# EAGLE design ESP32UsbHost (EAGLE 8.7.0)
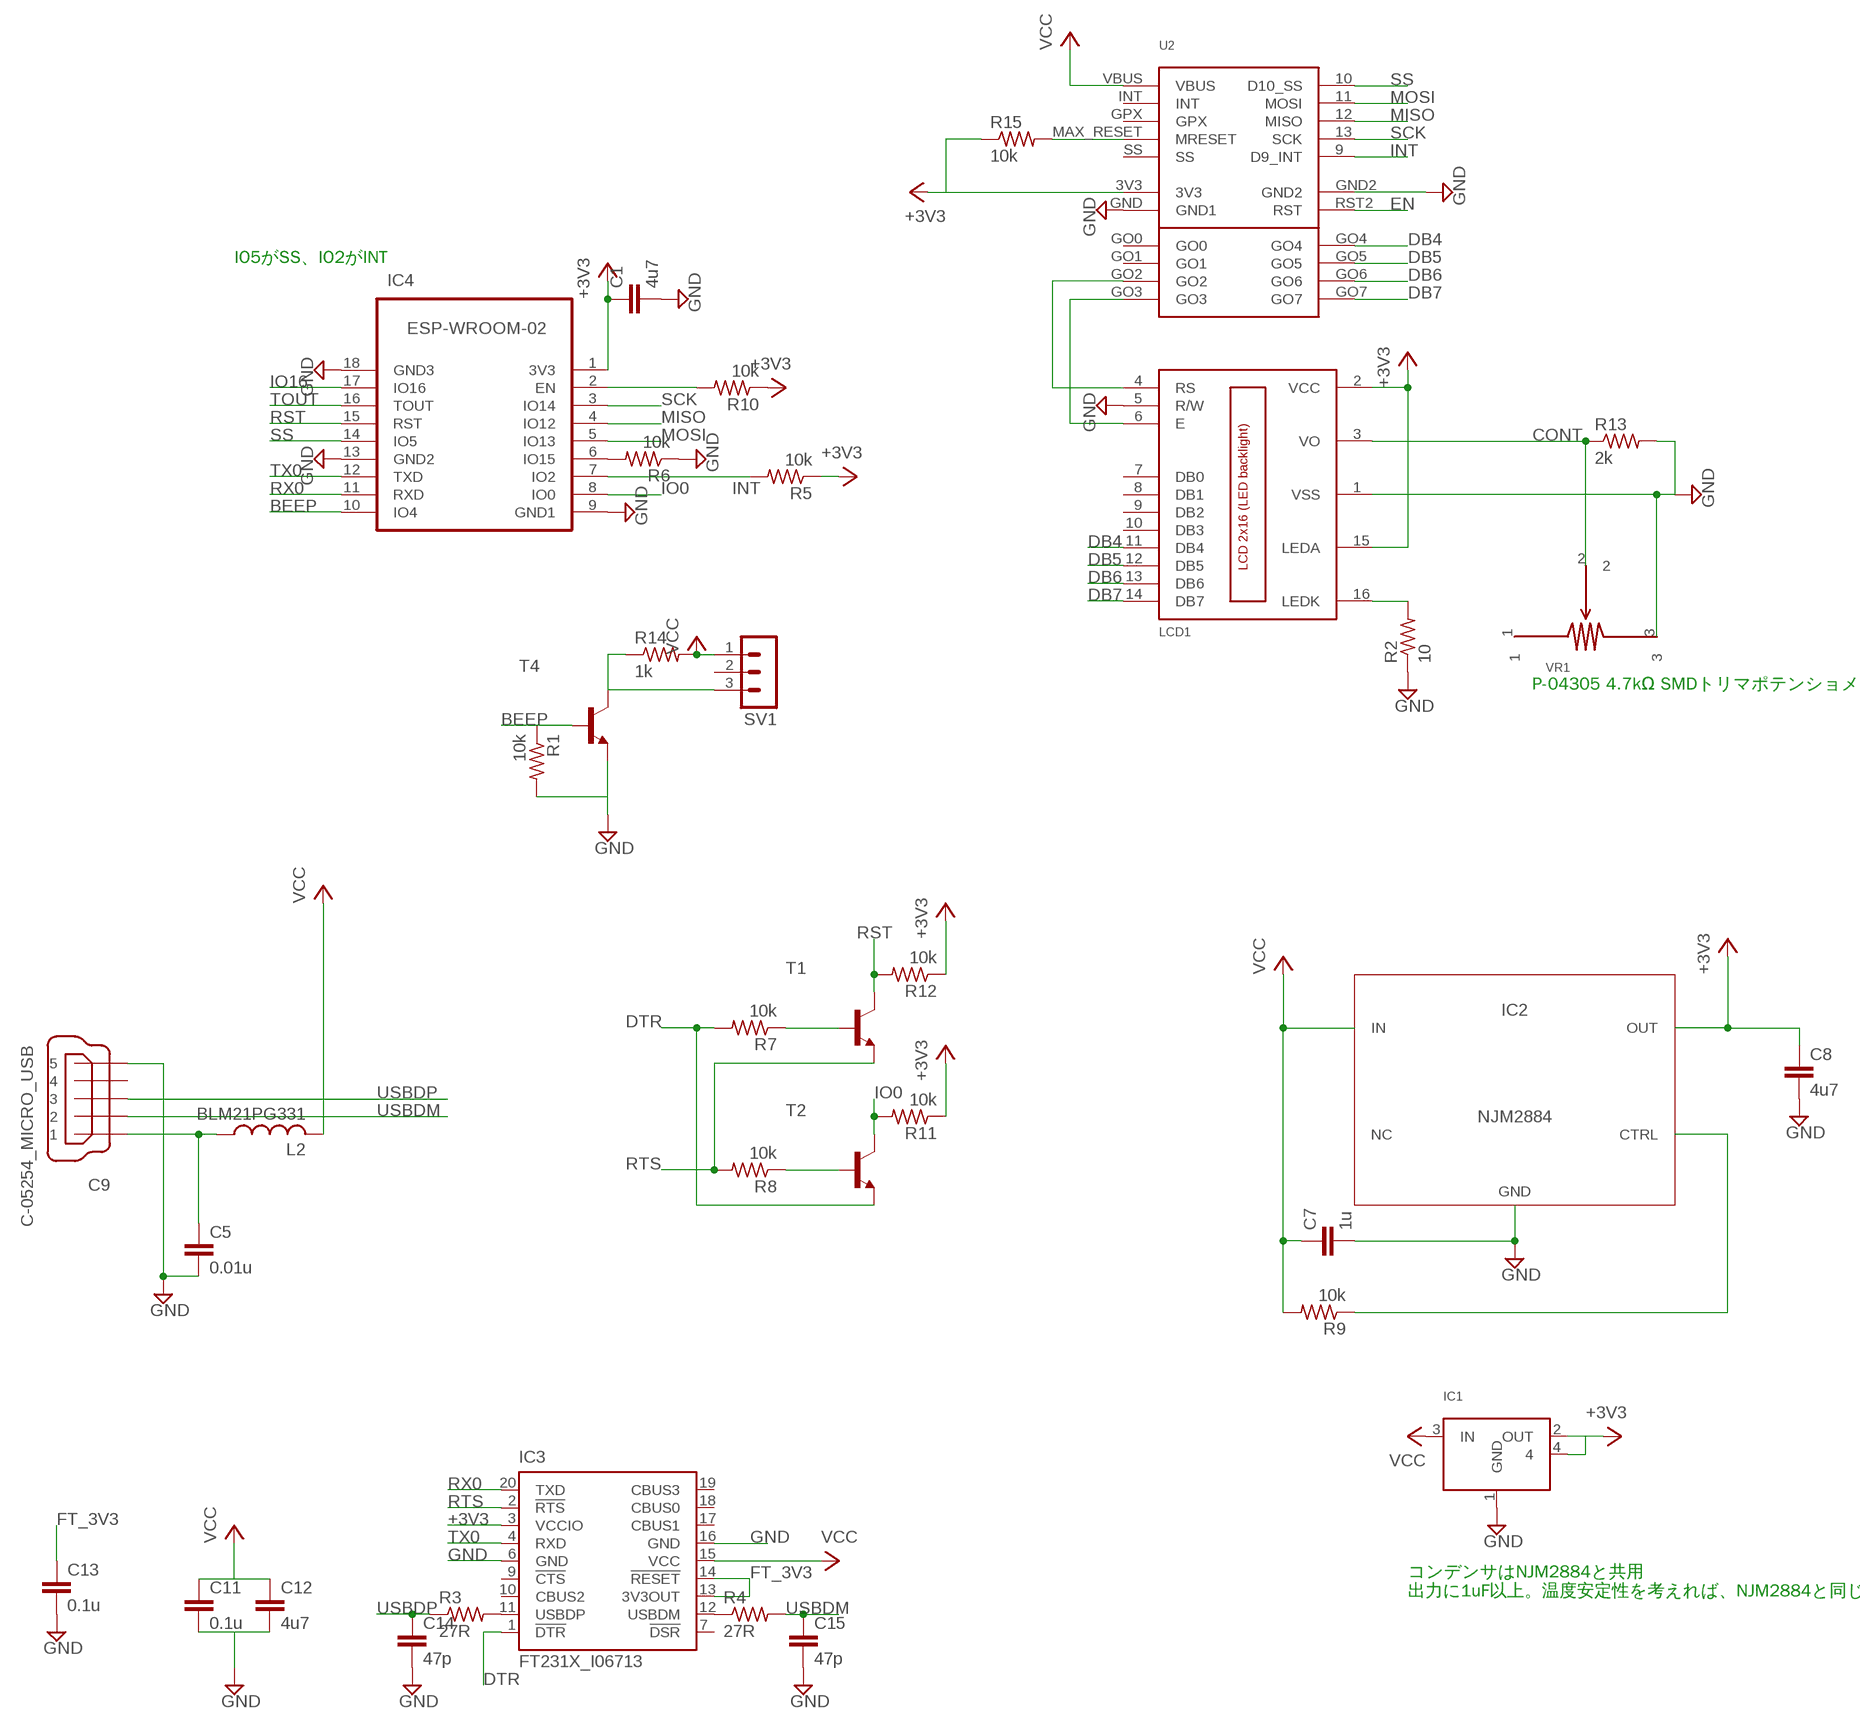
[diagram p0: schematic, sheet 1]

## Parts
C1  4u7  C-EUC0603  [C0603]
C5  0.01u  C-EUC0603  [C0603]
C7  1u  C-EUC0603  [C0603]
C8  4u7  C-EUC0603  [C0603]
C9  C-05254_MICRO_USB  [C-05254_MICRO_USB]
C11  0.1u  C-EUC0603  [C0603]
C12  4u7  C-EUC0603  [C0603]
C13  0.1u  C-EUC0603  [C0603]
C14  47p  C-EUC0603  [C0603]
C15  47p  C-EUC0603  [C0603]
IC1  I-12635_ADP3338AKCZ  [SOT223]
IC2  NJM2884  [SOT89-5]
IC3  FT231X_I06713  [SSOP20(2)]
IC4  ESP-WROOM-02  [FRONT-FACE_HANDSOLDER]
L2  BLM21PG331  L-USL2012C  [L2012C]
LCD1  LCD_2X16CONN_ONLY  [HY-1602F_2]
R1  10k  R-US_R0603  [R0603]
R2  10  R-US_R0603  [R0603]
R3  27R  R-US_R0603  [R0603]
R4  27R  R-US_R0603  [R0603]
R5  10k  R-US_R0603  [R0603]
R6  10k  R-US_R0603  [R0603]
R7  10k  R-US_R0603  [R0603]
R8  10k  R-US_R0603  [R0603]
R9  10k  R-US_R0603  [R0603]
R10  10k  R-US_R0603  [R0603]
R11  10k  R-US_R0603  [R0603]
R12  10k  R-US_R0603  [R0603]
R13  2k  R-US_R0603  [R0603]
R14  1k  R-US_R0603  [R0603]
R15  10k  R-US_R0603  [R0603]
SV1  MA03-1  [MA03-1]
T1  BC808-NPN-SOT23-BEC  [SOT23-BEC]
T2  BC808-NPN-SOT23-BEC  [SOT23-BEC]
T4  BC808-NPN-SOT23-BEC  [SOT23-BEC]
U2  USB_HOST_MINI  [USB_HOST_MINI]
VR1  P-04305_PVZ3_VR_POTENTION_METER  [VR_POTENTION_METER]

## Nets
+3V3 [pow]: C1.1 C8.1 IC1.2(OUT) IC1.4 IC2.4(OUT) IC3.3(VCCIO) IC4.1(3V3) LCD1.2(VCC) LCD1.15(LEDA) R5.1 R10.1 R11.1 R12.1 R15.1 U2.3V3
BEEP: IC4.10(IO4) R1.1 T4.B
CONT: LCD1.3(VO) R13.1 VR1.2
DB4: LCD1.11(DB4) U2.GO4
DB5: LCD1.12(DB5) U2.GO5
DB6: LCD1.13(DB6) U2.GO6
DB7: LCD1.14(DB7) U2.GO7
DTR: IC3.1(!DTR) R7.2 T2.E
EN: U2.RST2(RST)
FT_3V3: C13.1 IC3.13(3V3OUT) IC3.14(!RESET)
GND [pow]: C1.2 C5.2 C7.2 C8.2 C9.5 C11.2 C12.2 C13.2 C14.2 C15.2 IC1.1(GND) IC2.2(GND) IC3.6(GND) IC3.16(GND) IC4.9(GND1) IC4.13(GND2) IC4.18(GND3) LCD1.1(VSS) LCD1.5(R/W) R1.2 R2.1 R6.1 R13.2 T4.E U2.GND2 U2.GND(GND1) VR1.3
INT: IC4.7(IO2) R5.2 U2.9(D9_INT)
IO0: IC4.8(IO0) R11.2 T2.C
IO16: IC4.17(IO16)
MISO: IC4.4(IO12) U2.12(MISO)
MOSI: IC4.5(IO13) U2.11(MOSI)
N$1: IC4.6(IO15) R6.2
N$2: LCD1.6(E) U2.GO3
N$3: LCD1.4(RS) U2.GO2
N$4 [pow]: LCD1.16(LEDK) R2.2
N$5: IC3.12(USBDM) R4.1
N$6: IC3.11(USBDP) R3.2
N$7: IC4.2(EN) R10.2
N$8: R14.1 SV1.3 T4.C
N$9: R15.2 U2.MAX_RESET(MRESET)
N$10: R7.1 T1.B
N$11 [pow]: C5.1 C9.1 L2.1
N$14: R8.1 T2.B
N$17: IC2.1(CTRL) R9.1
RST: IC4.15(RST) R12.2 T1.C
RTS: IC3.2(!RTS) R8.2 T1.E
RX0: IC3.20(TXD) IC4.11(RXD)
SCK: IC4.3(IO14) U2.13(SCK)
SS: IC4.14(IO5) U2.10(D10_SS)
TOUT: IC4.16(TOUT)
TX0: IC3.4(RXD) IC4.12(TXD)
USBDM: C9.2 C15.1 R4.2
USBDP: C9.3 C14.1 R3.1
VCC [pow]: C7.1 C11.1 C12.1 IC1.3(IN) IC2.5(IN) IC3.15(VCC) L2.2 R9.2 R14.2 SV1.1 U2.VBUS
Unconnected: C9.4 IC2.3(NC) IC3.7(!DSR) IC3.9(!CTS) IC3.10(CBUS2) IC3.17(CBUS1) IC3.18(CBUS0) IC3.19(CBUS3) LCD1.7(DB0) LCD1.8(DB1) LCD1.9(DB2) LCD1.10(DB3) SV1.2 U2.GO0 U2.GO1 U2.GPX U2.INT U2.SS VR1.1

## Notes on the sheet
- IO5がSS、IO2がINT
- P-04305 4.7kΩ SMDトリマポテンショメータ
- コンデンサはNJM2884と共用
  出力に1uF以上。温度安定性を考えれば、NJM2884と同じく4u7。

## Library data of the parts
C1 C5 C7 C8 C11-C15 = rcl:C-EU: CAPACITOR, European symbol; SPICEPREFIX: C
C9 = Akizuki:C-05254_MICRO_USB
IC1 = Akizuki:I-12635_ADP3338AKCZ
IC2 = nrj-semiconductor:NJM2884
IC3 = Akizuki:FT231X_I06713
IC4 = esp-wroom-02:ESP-WROOM-02: WiFi module - ESP-WROOM-02
L2 = rcl:L-US: INDUCTOR, American symbol; SPICEPREFIX: L
LCD1 = lcd_2x16_led_backlight:LCD_2X16
R1-R15 = rcl:R-US_: RESISTOR, American symbol; SPICEPREFIX: R
SV1 = con-lstb:MA03-1: PIN HEADER; OC_FARNELL: unknown; OC_NEWARK: unknown
T1 T2 T4 = transistor-neu-to92:*-NPN-: NPN Transistror
U2 = Amazon:USB_HOST_MINI
VR1 = Akizuki:P-04305_PVZ3_VR_POTENTION_METER

## Board
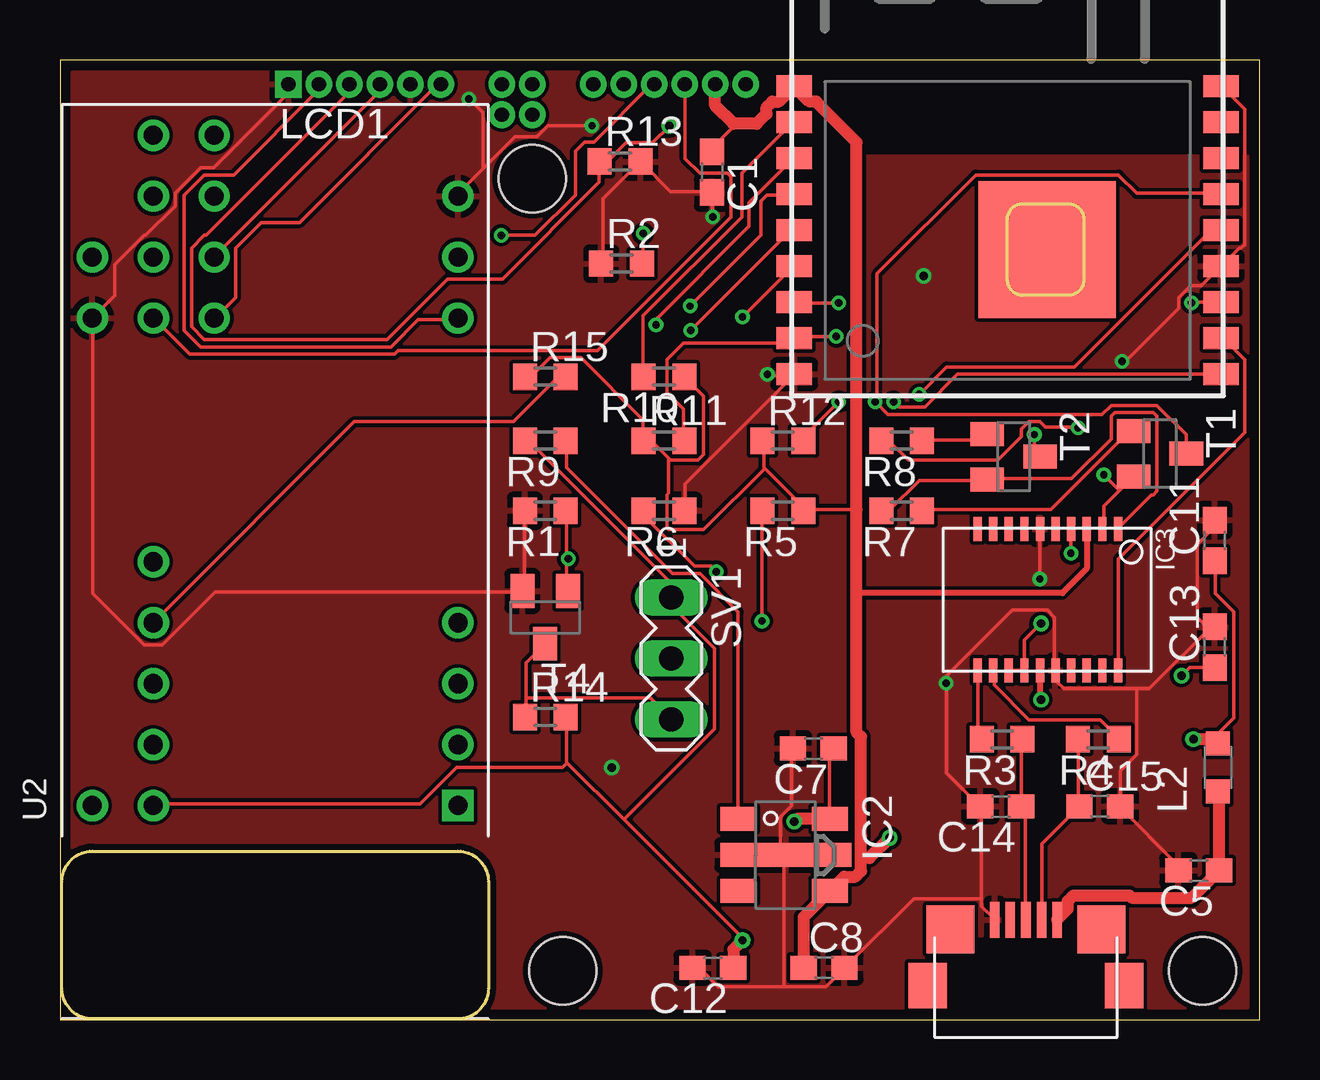
[diagram p1: board, top side]
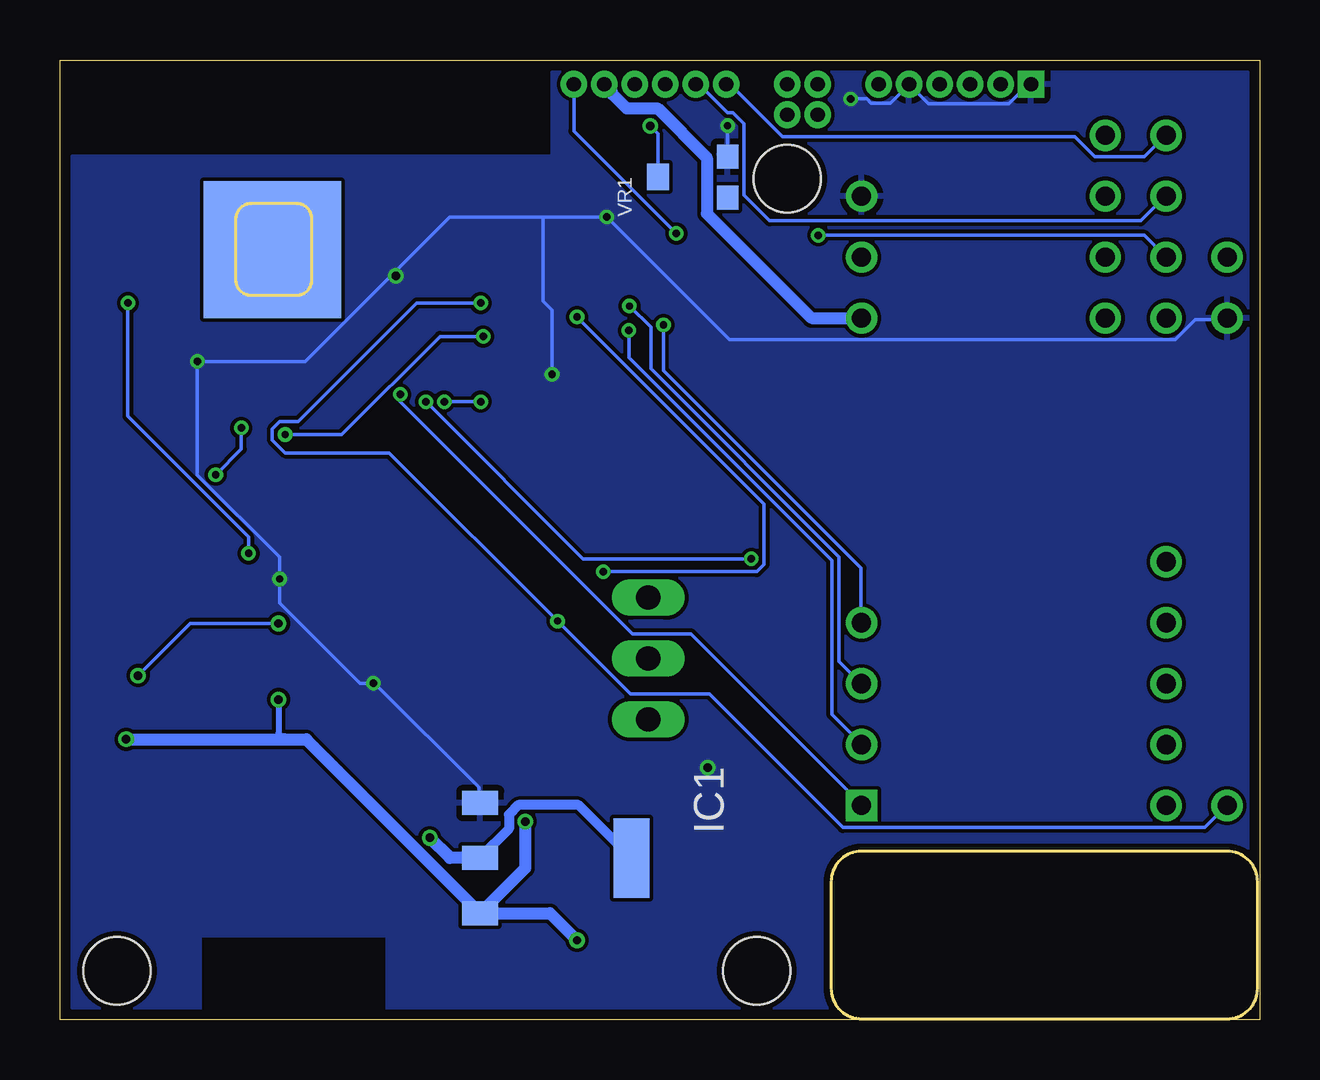
[diagram p2: board, bottom side, seen from below]

Size 50 x 40 mm. Coordinates in mm from the lower left corner, seen from the top.
Outline: 0,0 50,0 50,40 0,40 0,0
Copper layers (1*16): Top 0.035mm / dielectric 1.5mm / Bottom 0.035mm
Design rules "SeeedStudio_2layer_DRU_no_angle_20140221": minimum track width 6mil, minimum drill 12mil, track to track 6mil, track to pad 6mil, pad to pad 6mil, via to via 6mil, smd to smd 0mil, copper to edge 10mil, drill to drill 10mil, minimum pad ring 10mil, minimum via ring 6mil, stop-mask expansion 2mil, vias tented up to drill 100mil, thermal gap 10mil
Holes 2.8 mm at 19.68,35.05 47.62,2.03 20.95,2.03
vRestrict: area 36.8,7.6 to 45.7,12.7; area 18,19.6 to 36.8,25.4; area 17.8,25.1 to 27.1,27.9; area 36.7,22 to 39.1,23.4

### Footprints (pad centres in the part's own frame; a part is rotated, then mirrored left to right if it is on the bottom)
C0603 = smd 1.1 x 1: 1 -0.85,0; 2 0.85,0
C-05254_MICRO_USB = smd 0.4 x 1.5: 1 1.3,0.75; 2 0.65,0.75; 3 0,0.75; 4 -0.65,0.75; 5 -1.3,0.75 | smd 2 x 2: NC1 3.15,0.35; NC2 -3.15,0.35 | smd 1.6 x 1.9: P$6 -4.1,-2; P$7 4.1,-2
SOT223 = smd 1 x 1.5: 1 -2.3,0; 2 0,0; 3 2.3,0 | smd 3.3 x 1.5: 4 0,6.3
SOT89-5 = smd 1 x 1.5: 1 -1.499,-1.981; 3 1.499,-1.981; 4 1.499,1.829; 5 -1.499,1.829 | smd 1 x 5.454: 2 0,0
SSOP20(2) = smd 0.35 x 1: 1 -2.95,-2.95; 2 -2.3,-2.95; 3 -1.65,-2.95; 4 -1,-2.95; 5 -0.35,-2.95; 6 0.3,-2.95; 7 0.95,-2.95; 8 1.6,-2.95; 9 2.25,-2.95; 10 2.9,-2.95; 11 2.9,2.95; 12 2.25,2.95; 13 1.6,2.95; 14 0.95,2.95; 15 0.3,2.95; 16 -0.35,2.95; 17 -1,2.95; 18 -1.65,2.95; 19 -2.3,2.95; 20 -2.95,2.95
FRONT-FACE_HANDSOLDER = smd 1.485 x 0.9: 1 -8.893,4.9; 2 -8.893,3.4; 3 -8.893,1.9; 4 -8.893,0.4; 5 -8.893,-1.1; 6 -8.893,-2.6; 7 -8.893,-4.1; 8 -8.893,-5.6; 9 -8.893,-7.1; 10 8.893,-7.1; 11 8.893,-5.6; 12 8.893,-4.1; 13 8.893,-2.6; 14 8.893,-1.1; 15 8.893,0.4; 16 8.893,1.9; 17 8.893,3.4; 18 8.893,4.9 | smd 5.715 x 5.715: P$1 1.651,-1.905 | smd 5.715 x 5.715 bottom: P$2 1.651,-1.905
L2012C = smd 1 x 1: 1 -1,0; 2 1,0
HY-1602F_2 = drill 0.6 square: 1 0,0 | drill 0.6: 2 1.27,0; 3 2.54,0; 4 3.81,0; 5 5.08,0; 6 6.35,0; 7 8.89,0; 8 10.16,0; 9 8.89,-1.27; 10 10.16,-1.27; 11 12.7,0; 12 13.97,0; 13 15.24,0; 14 16.51,0; 15 17.78,0; 16 19.05,0
R0603 = smd 1 x 1.1: 1 -0.85,0; 2 0.85,0
MA03-1 = drill 1.016 long: 1 -2.54,0; 2 0,0; 3 2.54,0
SOT23-BEC = smd 1 x 1.4: B -0.95,-1.1; C 0,1.1; E 0.95,-1.1
USB_HOST_MINI = drill 0.8: 3V3 21.59,1.27; 9 1.27,16.51; 11 3.81,1.27; 12 6.35,1.27; 13 8.89,1.27; GND 26.67,1.27; GND2 21.59,16.51; GO0 29.21,11.43; GO1 26.67,11.43; GO2 24.13,11.43; GO3 21.59,11.43; GO4 29.21,13.97; GO5 26.67,13.97; GO6 24.13,13.97; GO7 21.59,13.97; GPX 6.35,13.97; INT 3.81,13.97; MAX_RESET 8.89,13.97; NC 24.13,1.27; RST2 24.13,16.51; SS 11.43,13.97; VBUS 1.27,13.97 | drill 0.8 square: 10 1.27,1.27
VR_POTENTION_METER = smd 1 x 0.9: 1 -0.85,-1.45; 3 0.85,-1.45 | smd 1.1 x 0.9: 2 0,1.45

### Placement (x,y rotation side)
C1  27.18,35.32 270 top
C5  47.47,6.22 180 top
C7  31.4,11.3 180 top
C8  31.85,2.16 0 top
C9  40.26,3.41 0 top
C11  48.13,19.97 90 top
C12  27.21,2.16 180 top
C13  48.13,15.53 90 top
C14  39.21,8.89 180 top
C15  43.34,8.89 0 top
IC1  32.48,6.73 270 bottom
IC2  30.26,6.86 270 top
IC3  41.15,17.5 180 top
IC4  39.5,34.01 0 top
L2  48.26,10.51 90 top
LCD1  9.53,38.99 0 top
R1  20.23,21.21 180 top
R2  23.41,31.51 0 top
R3  39.27,11.68 180 top
R4  43.28,11.68 180 top
R5  30.13,21.21 180 top
R6  25.18,21.21 180 top
R7  35.08,21.21 180 top
R8  35.08,24.13 180 top
R9  20.23,24.13 180 top
R10  25.18,26.8 180 top
R11  25.18,24.13 0 top
R12  30.13,24.13 0 top
R13  23.34,35.77 0 top
R14  20.23,12.61 0 top
R15  20.23,26.8 0 top
SV1  25.48,15.05 270 top
T1  45.85,23.59 270 top
T2  39.75,23.46 270 top
T4  20.23,16.76 180 top
U2  17.86,7.65 90 top
VR1  23.62,35.12 90 bottom

### Tracks (layer width: path | path; a pad name or v marks a point on that pad's centre or on a via)
+3V3  (via drill 0.35)
  Top 0.152: 25.41,23.36 25.45,23.32 26.59,23.32 26.82,23.55 26.82,25.98 26.06,26.75 R10.1 | 25.41,23.36 24.69,24.08 24.38,24.08 R11.1 24.31,24.16 24.31,24.99 21.72,27.58 20.42,27.58 19.66,26.82 19.43,26.82 R15.1 | 33.21,21.26 31.01,21.26 R5.1 31.01,21.34 29.38,22.97 | 29.38,22.97 29.34,23.01 29.34,24.08 R12.1 | C1.1 27.2,36.2 27.2,36.35 27.96,37.11 28.07,37.34 | LCD1.2 10.74,38.94 10.74,38.71 7.24,35.2 6.02,35.2 5.18,34.37 5.18,28.73 5.87,28.04 13.79,28.04 14.94,29.18 16.54,29.18 U2.3V3 | 29.38,22.97 26.82,20.42 25.38,20.42 25.3,20.5 25.3,21.87 25.38,21.95 25.38,23.32 25.41,23.36 | 33.3,7.7 33.39,7.7
  Top 0.254: IC3.3 42.8,18.8 41.78,17.78 33.21,17.78
  Top 0.508: LCD1.15 27.3,38.1 28.07,37.34 29.04,37.34 29.46,37.76 29.46,38.02 29.69,38.26 29.96,38.26 IC4.1 31.25,38.26 31.52,38.26 33.21,36.57 33.21,21.26 33.21,17.78 33.21,11.97 33.39,11.79 33.39,7.7 33.39,6.73 | 33.39,6.73 33.39,6.19 33.15,5.95 32.68,5.95 IC2.4 31,4.27 C8.1 | v34.59,7.58 33.74,6.73 33.39,6.73
  Bottom 0.152: 32.46,6.78 IC1.2
  Bottom 0.406: 32.46,6.78 31.29,7.95 31.29,8.54 30.89,8.94 28.39,8.94 IC1.4
  Bottom 0.508: U2.3V3 18.67,29.24 23.03,33.6 23.03,35.92 25.1,37.98 26.38,37.98 27,38.59 27,38.68 LCD1.15 | IC1.2 33.74,6.73 v34.59,7.58
BEEP  (via drill 0.3)
  Top 0.152: 21.11,19.2 21.11,17.91 T4.B | 21.11,19.2 21.11,21.18 R1.1 | v34.75,25.76 34.98,25.53 36.04,25.53 37.41,26.9 IC4.10 | 21.11,19.2 v21.18,19.2
  Bottom 0.152: v34.75,25.76 28.19,19.2 v21.18,19.2
CONT  (via drill 0.35)
  Top 0.152: LCD1.3 12.04,38.94 12.04,38.63 6.1,32.69 6.02,32.69 5.49,32.16 5.49,28.88 6.02,28.35 13.64,28.35 16.15,30.86 18.44,30.86 22.48,34.9 22.48,35.74 R13.1 22.82,35.77 23.59,36.55 24.7,36.55 v25.4,37.25
  Bottom 0.152: VR1.2 25.07,36.92 v25.4,37.25
DB4
  Bottom 0.152: LCD1.11 22.17,38.94 22.02,38.94 19.89,36.8 7.7,36.8 6.86,35.97 4.8,35.97 3.96,36.8 U2.GO4
DB5
  Bottom 0.152: LCD1.12 23.47,38.94 23.32,38.94 22.17,37.8 21.95,37.8 21.49,37.34 21.49,34.37 20.42,33.3 4.95,33.3 3.96,34.29 U2.GO5
DB6  (via drill 0.3)
  Top 0.152: v18.39,32.69 19.81,32.69 21.49,34.37 21.49,36.2 21.87,36.58 22.25,36.58 24.61,38.94 24.77,38.94 LCD1.13
  Bottom 0.152: v18.39,32.69 4.8,32.69 3.96,31.85 U2.GO6
DB7
  Top 0.152: LCD1.14 26.06,38.94 26.06,35.89 26.67,35.28 27.81,35.28 27.96,35.13 27.96,33.45 22.4,27.89 14.1,27.89 13.95,27.74 5.41,27.74 3.96,29.18 U2.GO7
DTR
  Top 0.152: IC3.1 44.12,20.5 45.49,21.87 45.57,21.87 45.72,22.02 45.72,25.15 45.57,25.3 43.97,25.3 43.81,25.15 43.81,24.2 42.16,22.55 38.71,22.55 T2.E 38.63,22.48 35.81,22.48 34.59,21.26 34.29,21.26 R7.2
FT_3V3  (via drill 0.35)
  Top 0.152: 40.08,14.55 40.16,14.55 IC3.14 | 40.08,14.55 39.62,14.55 IC3.13 | 40.08,14.55 IC3.14 | IC3.14 40.2,15.81 v40.89,16.51 | v46.75,14.34 47.08,14.68 C13.1
  Bottom 0.152: v40.89,16.51 44.58,16.51 v46.75,14.34
GND  (via drill 0.3, 0.35)
  Top 0.152: v22.17,37.26 20.34,37.26 19.89,36.8 18.97,36.8 17.63,35.46 | 17.63,35.46 16.54,34.37 U2.GND | R1.2 19.36,21.18 19.36,17.98 19.28,17.91 T4.E 19.2,17.83 6.48,17.83 4.27,15.62 3.5,15.62 1.37,17.75 1.37,29.18 U2.GND2 1.37,29.26 2.29,30.18 2.29,31.47 3.5,32.69 3.58,32.69 4.8,33.91 4.8,34.44 5.87,35.51 6.4,35.51 9.53,38.63 LCD1.1 | C5.2 46.56,6.25 46.56,6.48 44.2,8.84 C15.2 44.2,8.91 44.2,10.36 44.88,11.05 44.88,13.79 | 44.88,13.79 45.41,13.79 47.93,16.31 48.08,16.31 C13.2 47.85,16.31 47.4,16.76 47.4,19.81 48.08,20.5 48.08,20.8 C11.2 | 44.88,13.79 41.83,13.79 41.53,14.1 41.53,14.48 IC3.16 | C7.2 30.48,11.28 30.48,8.91 30.02,8.46 30.02,7.09 IC2.2 30.18,6.86 30.18,1.37 | 38.41,5.03 38.41,4.72 38.94,4.19 C9.5 | 38.41,5.03 38.41,8.84 C14.2 38.33,8.91 36.96,10.29 36.96,14.02 | 30.18,1.37 31.93,1.37 32.69,2.13 C8.2 32.77,2.21 35.59,5.03 38.41,5.03 | 30.18,1.37 27.43,1.37 26.67,2.13 26.36,2.13 C12.2 | 41.45,15.01 41.45,14.55 | 41.45,14.55 IC3.16 | R6.1 26.06,21.26 26.06,22.33 30.63,26.9 IC4.9 30.4,26.75 v29.49,26.9 | R2.1 22.63,31.55 22.63,34.21 24.16,35.74 R13.2 24.23,35.74 25.45,34.52 27.13,34.52 C1.2 27.2,34.44 v27.2,33.45 | IC4.13 48.46,31.47 49.15,32.16 49.23,32.16 49.38,32.31 49.38,37.95 48.46,38.86 IC4.18 | v40.84,18.36 40.84,20.42 IC3.6 | 48.23,31.39 48.39,31.39 IC4.13 | v44.27,27.43 44.42,27.43 46.63,29.65 46.63,30.09 47.13,30.58 47.57,30.58 IC4.13 | 41.45,14.56 41.45,14.55 | v17.04,38.38 17.63,37.8 17.63,35.46 | 36.96,14.02 36.96,14.33 39.7,17.07 41.15,17.07 41.45,16.76 41.45,15.01 | 36.96,14.02 v36.93,14.02 | 41.45,15.01 IC3.16
  Bottom 0.152: v22.17,37.26 22.17,36.04 VR1.3 | LCD1.5 13.79,38.18 10.44,38.18 9.68,38.94 9.53,38.94 LCD1.1 | 14.48,38.79 LCD1.5 | 32.54,9.07 IC1.1 32.54,9.14 32.54,9.68 36.88,14.02 v36.93,14.02 37.49,14.02 40.84,17.37 v40.84,18.36 40.84,19.28 44.27,22.71 v44.27,27.43 39.78,27.43 33.76,33.45 29.87,33.45 | 29.87,33.45 v27.2,33.45 22.1,28.35 3.5,28.35 2.67,29.18 1.37,29.18 U2.GND2 | v29.49,26.9 29.49,29.57 29.87,29.95 29.87,33.45 | v17.04,38.38 16.37,38.38 16.2,38.21 15.39,38.21 LCD1.5
  other vias: 23,10.5 36,31
  pour Bottom: 0.5,39.5 29.5,39.5 29.5,36 49.5,36 49.5,0.5 0.5,0.5
  pour Top: 0.5,39.5 29.5,39.5 29.5,36 49.5,36 49.5,0.5 0.5,0.5
INT  (via drill 0.3)
  Top 0.152: v29.26,16.61 29.26,21.18 R5.2 | v32.46,29.87 30.63,29.87 IC4.7
  Bottom 0.152: U2.9 1.37,8.91 2.29,8 17.37,8 22.94,13.56 26.21,13.56 v29.26,16.61 36.27,23.62 40.61,23.62 41.15,24.16 41.15,24.61 40.84,24.92 40.08,24.92 35.13,29.87 v32.46,29.87
IO0  (via drill 0.3)
  Top 0.152: R11.2 25.98,24.16 25.98,25.45 25.3,26.14 25.3,27.51 25.98,28.19 30.4,28.19 30.56,28.35 IC4.8 30.63,28.42 30.68,28.47 v32.36,28.47 | T2.C 40.62,23.7 v40.62,24.38
  Bottom 0.152: v32.36,28.47 34.16,28.47 38.25,24.38 v40.62,24.38
MISO  (via drill 0.3)
  Top 0.152: IC4.4 30.56,34.37 29.46,34.37 29.21,34.11 29.21,32.69 v26.26,29.74
  Bottom 0.152: U2.12 16.61,14.02 17.53,14.94 17.53,19.28 25.38,27.13 25.38,28.85 v26.26,29.74
MOSI  (via drill 0.3)
  Top 0.152: v26.29,28.73 30.4,32.84 30.56,32.84 IC4.5
  Bottom 0.152: v26.29,28.73 26.29,27.58 17.83,19.13 17.83,12.72 16.61,11.51 U2.11
N$1  (via drill 0.3)
  Top 0.152: v27.36,18.67 27.13,18.9 26.44,18.9 24.38,20.95 24.38,21.18 R6.2 | v28.45,29.29 30.56,31.39 IC4.6
  Bottom 0.152: v27.36,18.67 20.95,18.67 20.65,18.97 20.65,21.49 v28.45,29.29
N$2
  Top 0.152: LCD1.6 15.85,38.94 15.7,38.94 9.98,33.22 8.38,33.22 7.32,32.16 7.32,30.1 6.48,29.26 U2.GO3
N$3
  Top 0.152: LCD1.4 13.34,38.71 6.48,31.85 U2.GO2
N$4  (via drill 0.3)
  Top 0.152: v24.31,32.77 24.31,31.55 R2.2
  Bottom 0.152: v24.31,32.77 28.57,37.03 LCD1.16
N$5
  Top 0.152: IC3.12 38.94,14.48 38.94,13.95 40.39,12.5 43.36,12.5 44.12,11.73 R4.1
N$6
  Top 0.152: IC3.11 38.25,14.48 38.25,11.89 38.41,11.73 R3.2
N$7
  Top 0.152: R10.2 24.31,26.82 24.31,29.34 28.42,33.45 28.42,35.28 30.56,37.41 IC4.2
N$8
  Top 0.152: 19.43,13.41 19.43,14.86 20.19,15.62 T4.C | 19.43,13.41 19.43,12.65 R14.1 | 19.43,13.41 24.61,13.41 25.45,12.57 SV1.3
N$9
  Top 0.152: R15.2 21.03,26.75 20.73,26.75 18.9,24.92 12.27,24.92 3.96,16.61 U2.MAX_RESET
N$10
  Top 0.152: R7.1 35.97,21.26 41.3,21.26 44.58,24.54 44.73,24.54 T1.B
N$11
  Top 0.508: C9.1 42,4.61 42,4.93 42.24,5.17 44.58,5.17 44.67,5.08 47.17,5.08 C5.1 48.32,9.45 L2.1
N$14
  Top 0.152: R8.1 35.97,24.16 38.41,24.16 38.63,24.38 T2.B
N$17
  Top 0.152: R9.1 21.11,24.08 21.11,23.01 25.53,18.59 26.67,18.59 28.27,16.99 28.27,8.38 IC2.1
RST  (via drill 0.3)
  Top 0.152: v32.46,25.76 31.01,24.31 31.01,24.16 R12.2 | T1.C 46.94,23.62 46.94,24.38 45.72,25.6 43.81,25.6 43.43,25.22 34.52,25.22 v33.98,25.76 34.06,25.76 34.06,31.09 38.18,35.2 44.12,35.2 44.88,34.44 48.39,34.44 IC4.15
  Bottom 0.152: v33.98,25.76 v32.46,25.76
RTS  (via drill 0.3)
  Top 0.152: 44.16,22.06 44.73,22.63 T1.E | 44.16,22.06 43.51,21.41 43.51,20.5 IC3.2 | 44.16,22.06 v43.51,22.71 | R8.2 34.29,24.08 34.59,24.08 35.36,23.32 39.09,23.32 40.08,24.31 40.08,24.61 40.39,24.92 40.84,24.92 41.07,24.69 42.44,24.69 v42.44,24.66
  Bottom 0.152: v42.44,24.66 42.44,23.77 v43.51,22.71
RX0
  Top 0.152: IC3.20 44.12,14.55 44.12,19.2 49.38,24.46 49.38,27.51 48.46,28.42 IC4.11
SCK  (via drill 0.3)
  Top 0.152: v24.84,28.96 24.84,29.18 28.73,33.07 28.73,34.06 30.56,35.89 IC4.3
  Bottom 0.152: v24.84,28.96 24.84,27.05 16.61,18.82 16.61,16.61 U2.13
SS  (via drill 0.3)
  Top 0.152: v35.81,26.06 36.96,27.2 42.29,27.2 47.93,32.84 48.39,32.84 IC4.14
  Bottom 0.152: v35.81,26.06 35.81,25.76 26.14,16.08 23.7,16.08 16.61,8.99 U2.10
TX0  (via drill 0.3)
  Top 0.152: v42.14,19.43 42.14,20.42 IC3.4 | 48.39,29.95 IC4.12 47.2,29.91 v47.17,29.87
  Bottom 0.152: v42.14,19.43 42.14,20.12 47.17,25.15 v47.17,29.87
USBDM
  Top 0.152: R4.2 42.44,11.66 42.44,8.91 C15.1 42.44,8.84 40.92,7.32 40.92,4.19 C9.2
USBDP
  Top 0.152: R3.1 40.08,11.66 40.08,8.91 C14.1 40.08,8.84 40.23,8.69 40.23,4.19 C9.3
VCC  (via drill 0.35)
  Top 0.152: R9.2 19.43,24.08 19.58,24.08 25.45,18.21 25.45,17.6 SV1.1 25.53,17.53 25.53,17.22 27.28,15.47 27.28,12.12 23.51,8.34 | 23.51,8.34 28.35,3.5 v28.45,3.3 | 23.51,8.34 21.14,10.71 | 21.14,10.71 21.11,10.74 21.11,12.57 R14.2 | C7.1 32.08,10.9 32.08,8.61 IC2.5 | C11.1 48.16,19.05 48.16,17.75 48.92,16.99 48.92,12.57 48.23,11.89 L2.2 | 21.14,10.71 20.95,10.52 16.54,10.52 15.01,8.99 3.96,8.99 U2.VBUS
  Top 0.254: IC3.15 40.85,13.38 v40.89,13.34
  Top 0.508: 32.09,11.14 C7.1 | L2.2 48.09,11.68 v47.24,11.68 | IC2.5 30.71,8.36 v30.61,8.26 | v28.45,3.3 28.06,2.92 C12.1
  Bottom 0.254: v40.89,13.34 40.89,11.94 40.64,11.68
  Bottom 0.508: v47.24,11.68 40.64,11.68 39.73,11.68 IC1.3 | v30.61,8.26 30.61,6.3 IC1.3 | IC1.3 29.58,4.43 v28.45,3.3